# EAGLE design dev-board (EAGLE 7.0.0)
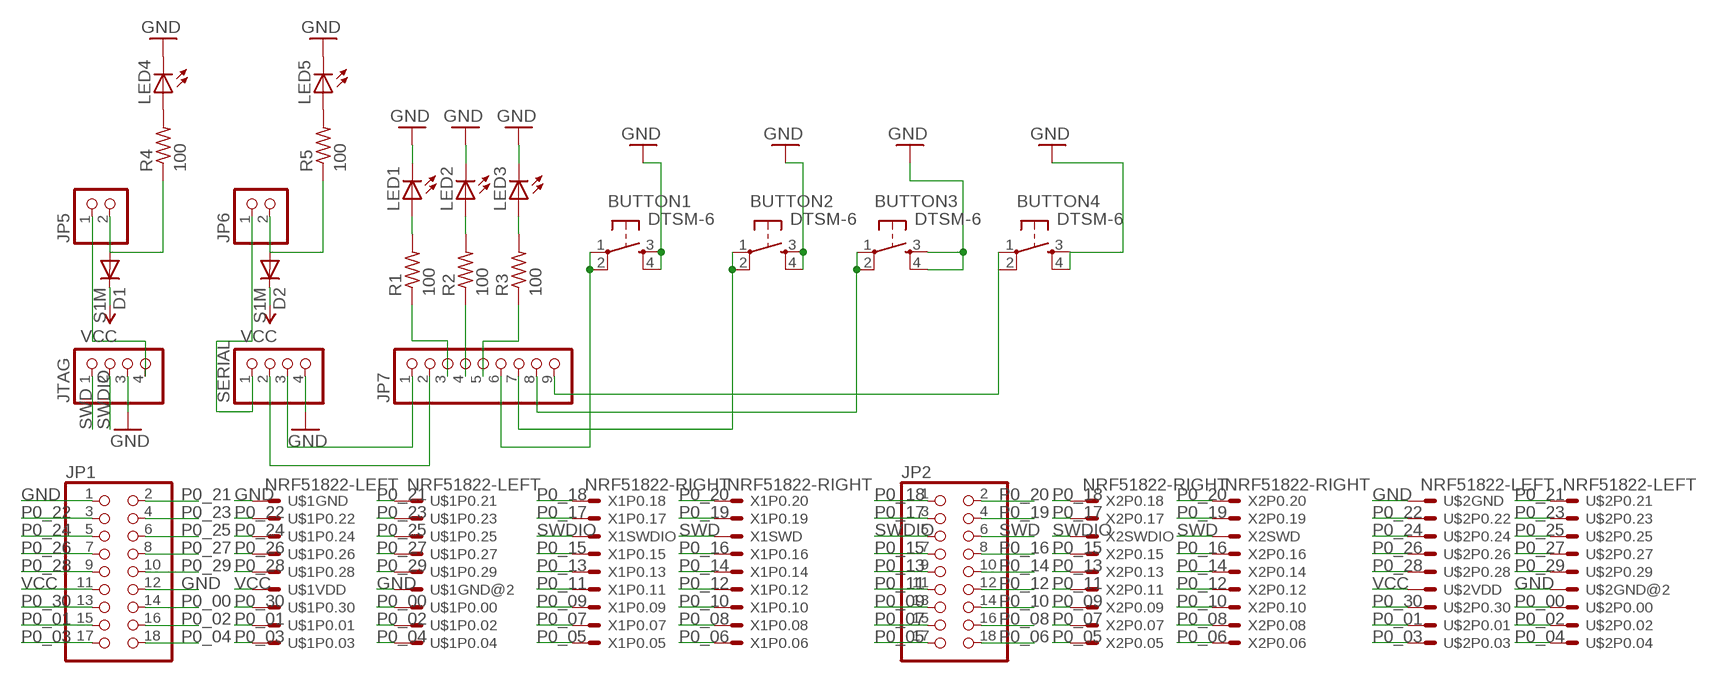
[diagram p0: schematic, sheet 1]

## Parts
BUTTON1  DTSM-6  [DTSM-6]
BUTTON2  DTSM-6  [DTSM-6]
BUTTON3  DTSM-6  [DTSM-6]
BUTTON4  DTSM-6  [DTSM-6]
D1  S1M  [SMA]
D2  S1M  [SMA]
JP1  PINHD-2X9  [2X09]
JP2  PINHD-2X9  [2X09]
JP5  PINHD-1X2  [1X02]
JP6  PINHD-1X2  [1X02]
JP7  PINHD-1X9  [1X09]
JTAG  PINHD-1X4  [1X04]
LED1  LEDSML0603  [SML0603]
LED2  LEDSML0603  [SML0603]
LED3  LEDSML0603  [SML0603]
LED4  LEDSML0603  [SML0603]
LED5  LEDSML0603  [SML0603]
R1  100  R-US_R0603  [R0603]
R2  100  R-US_R0603  [R0603]
R3  100  R-US_R0603  [R0603]
R4  100  R-US_R0603  [R0603]
R5  100  R-US_R0603  [R0603]
SERIAL  PINHD-1X4  [1X04]
U$1  NRF51822-LEFT  [NRF51822-LEFT]
U$2  NRF51822-LEFT  [NRF51822-LEFT]
X1  NRF51822-RIGHT  [NRF51822-RIGHT]
X2  NRF51822-RIGHT  [NRF51822-RIGHT]

## Nets
GND: BUTTON1.3 BUTTON1.4 BUTTON2.3 BUTTON2.4 BUTTON3.3 BUTTON3.4 BUTTON4.3 BUTTON4.4 JP1.1 JP1.12 JTAG.3 LED1.C LED2.C LED3.C LED4.C LED5.C SERIAL.4 U$1.1 U$1.12 U$2.1 U$2.12
N$1: LED1.A R1.2
N$2: LED2.A R2.2
N$3: LED3.A R3.2
N$4: JP7.1 SERIAL.3
N$5: JP7.2 SERIAL.2
N$6: JP6.1 SERIAL.1
N$7: JP7.3 R1.1
N$8: JP7.4 R2.1
N$9: JP5.1 JTAG.4
N$10: JP7.5 R3.1
N$11: BUTTON3.1 BUTTON3.2 JP7.8
N$12: LED4.A R4.2
N$13: BUTTON2.1 BUTTON2.2 JP7.7
N$15: LED5.A R5.2
N$16: BUTTON1.1 BUTTON1.2 JP7.6
N$17: BUTTON4.1 BUTTON4.2 JP7.9
N$18: D1.A JP5.2 R4.1
N$19: D2.A JP6.2 R5.1
P0_00: JP1.14 U$1.14 U$2.14
P0_01: JP1.15 U$1.15 U$2.15
P0_02: JP1.16 U$1.16 U$2.16
P0_03: JP1.17 U$1.17 U$2.17
P0_04: JP1.18 U$1.18 U$2.18
P0_05: JP2.17 X1.17 X2.17
P0_06: JP2.18 X1.18 X2.18
P0_07: JP2.15 X1.15 X2.15
P0_08: JP2.16 X1.16 X2.16
P0_09: JP2.13 X1.13 X2.13
P0_10: JP2.14 X1.14 X2.14
P0_11: JP2.11 X1.11 X2.11
P0_12: JP2.12 X1.12 X2.12
P0_13: JP2.9 X1.9 X2.9
P0_14: JP2.10 X1.10 X2.10
P0_15: JP2.7 X1.7 X2.7
P0_16: JP2.8 X1.8 X2.8
P0_17: JP2.3 X1.3 X2.3
P0_18: JP2.1 X1.1 X2.1
P0_19: JP2.4 X1.4 X2.4
P0_20: JP2.2 X1.2 X2.2
P0_21: JP1.2 U$1.2 U$2.2
P0_22: JP1.3 U$1.3 U$2.3
P0_23: JP1.4 U$1.4 U$2.4
P0_24: JP1.5 U$1.5 U$2.5
P0_25: JP1.6 U$1.6 U$2.6
P0_26: JP1.7 U$1.7 U$2.7
P0_27: JP1.8 U$1.8 U$2.8
P0_28: JP1.9 U$1.9 U$2.9
P0_29: JP1.10 U$1.10 U$2.10
P0_30: JP1.13 U$1.13 U$2.13
SWD: JP2.6 JTAG.1 X1.6 X2.6
SWDIO: JP2.5 JTAG.2 X1.5 X2.5
VCC: D1.C D2.C JP1.11 U$1.11 U$2.11

## Library data of the parts
BUTTON1-BUTTON4 = switch-tact:DTSM-6
D1 D2 = icarus_sensors:S1M
JP1 JP2 = pinhead:PINHD-2X9: PIN HEADER
JP5 JP6 = pinhead:PINHD-1X2: PIN HEADER
JP7 = pinhead:PINHD-1X9: PIN HEADER
JTAG SERIAL = pinhead:PINHD-1X4: PIN HEADER
LED1-LED5 = led:LED: LED OSRAM: - CHIPLED LG R971, LG N971, LY N971, LG Q971, LY Q971, LO R971, LY R971 LH N974, LH R974 LS Q976, LO Q976, LY Q976 LO Q996 - Hyper CHIPLED LW Q18S LB Q993, LB Q99A, LB R99A - SideLED LS A670, LO A670, LY A670, LG A670, LP A670 LB A673, LV A673, LT A673, LW A673 LH A674 LY A675 LS A676, LA A676, LO A676, LY A676, LW A676 LS A679, LY A679, LG A679 - Hyper Micro SIDELED® LS Y876, LA Y876, LO Y876, LY Y876 LT Y87S - SmartLED LW L88C, LW L88S LB L89C, LB L89S, LG L890 LS L89K, LO L89K, LY L89K LS L896, LA L896, LO L896, LY L896 - TOPLED LS T670, LO T670, LY T670, LG T670, LP T670 LSG T670, LSP T670, LSY T670, LOP T670, LYG T670 LG T671, LOG T671, LSG T671 LB T673, LV T673, LT T673, LW T673 LH T674 LS T676, LA T676, LO T676, LY T676, LB T676, LH T676, LSB T676, LW T676 LB T67C, LV T67C, LT T67C, LS T67K, LO T67K, LY T67K, LW E67C LS E67B, LA E67B, LO E67B, LY E67B, LB E67C, LV E67C, LT E67C LW T67C LS T679, LY T679, LG T679 LS T770, LO T770, LY T770, LG T770, LP T770 LB T773, LV T773, LT T773, LW T773 LH T774 LS E675, LA E675, LY E675, LS T675 LS T776, LA T776, LO T776, LY T776, LB T776 LHGB T686 LT T68C, LB T68C - Hyper Mini TOPLED® LB M676 - Mini TOPLED Santana® LG M470 LS M47K, LO M47K, LY M47K Source: http://www.osram.convergy.de LUXEON: - LUMILED® LXK2-PW12-R00, LXK2-PW12-S00, LXK2-PW14-U00, LXK2-PW14-V00 LXK2-PM12-R00, LXK2-PM12-S00, LXK2-PM14-U00 LXK2-PE12-Q00, LXK2-PE12-R00, LXK2-PE12-S00, LXK2-PE14-T00, LXK2-PE14-U00 LXK2-PB12-K00, LXK2-PB12-L00, LXK2-PB12-M00, LXK2-PB14-N00, LXK2-PB14-P00, LXK2-PB14-Q00 LXK2-PR12-L00, LXK2-PR12-M00, LXK2-PR14-Q00, LXK2-PR14-R00 LXK2-PD12-Q00, LXK2-PD12-R00, LXK2-PD12-S00 LXK2-PH12-R00, LXK2-PH12-S00 LXK2-PL12-P00, LXK2-PL12-Q00, LXK2-PL12-R00 Source: www.luxeon.com KINGBRIGHT: KA-3528ASYC Source: www.kingbright.com
R1-R5 = resistor:R-US_: RESISTOR, American symbol
U$1 U$2 = icarus_sensors:NRF51822-LEFT: left connector of NFR518822 board; MPN: NRF51822-left; OC_FARNELL: unknown; OC_NEWARK: 25M5675
X1 X2 = icarus_sensors:NRF51822-RIGHT: right connector of NFR518822 board; MPN: NRF51822-right; OC_FARNELL: unknown; OC_NEWARK: 25M5675

## Board
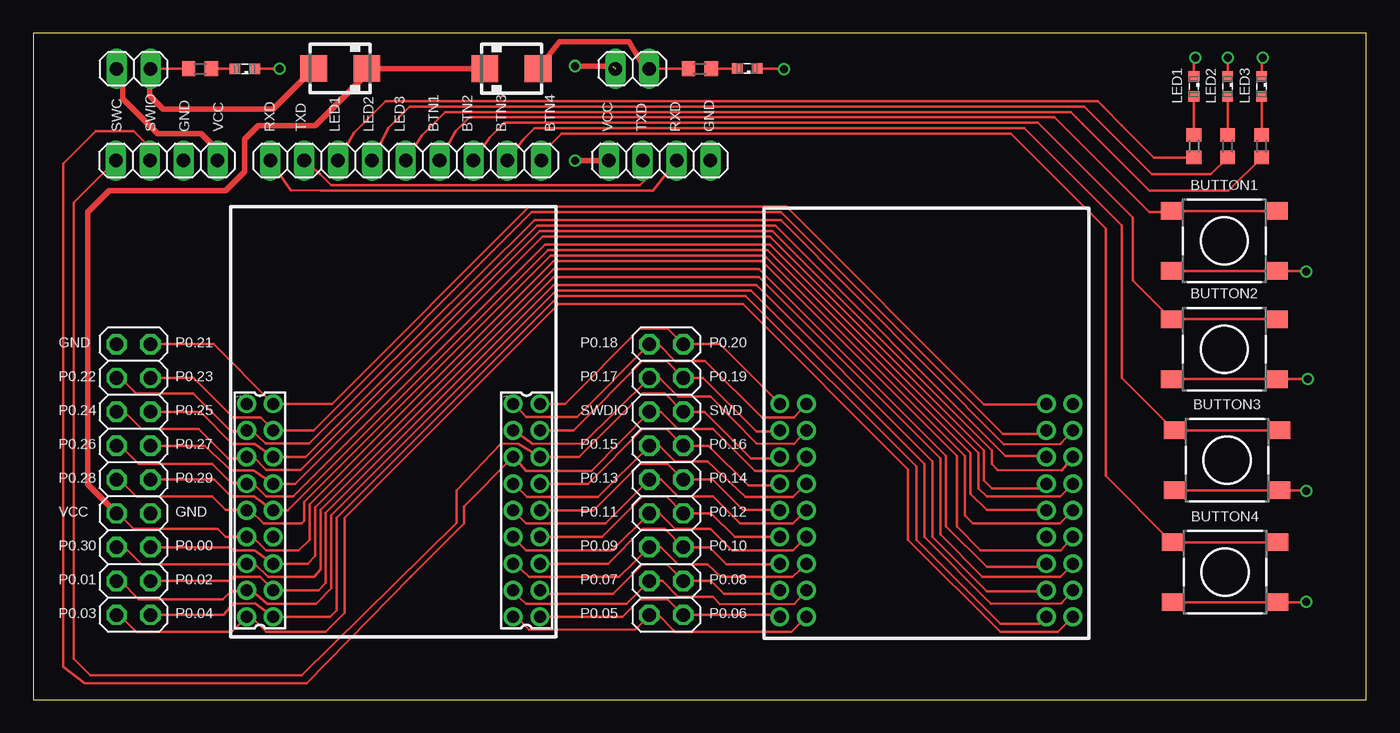
[diagram p1: board, top side]
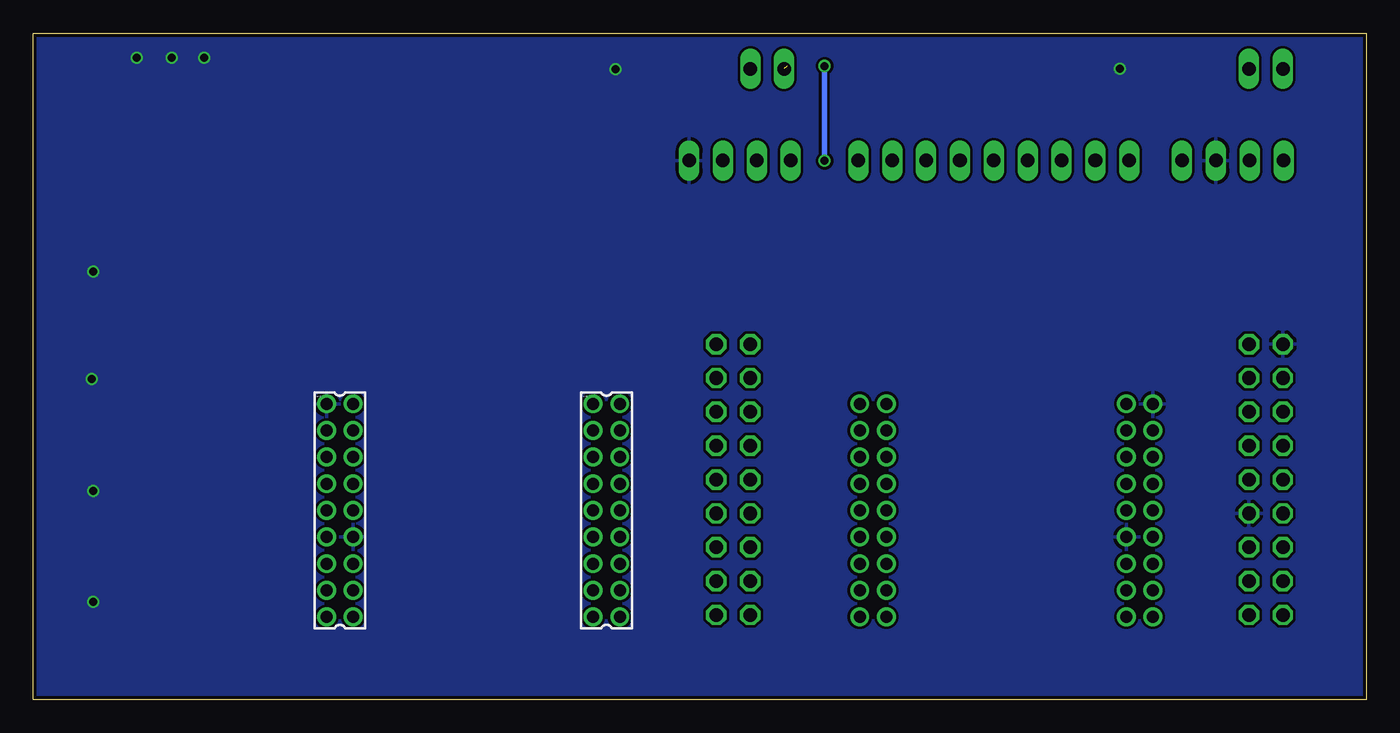
[diagram p2: board, bottom side, seen from below]

Size 100 x 50 mm. Coordinates in mm from the lower left corner, seen from the top.
Outline: 0,0 100,0 100,50 0,50 0,0
Copper layers (1*16): Top 0.035mm / dielectric 1.5mm / Bottom 0.035mm
Design rules "Elecrow_2-layer_eagle_rule *": minimum track width 6mil, minimum drill 12mil, track to track 8mil, track to pad 6mil, pad to pad 6mil, via to via 6mil, smd to smd 0mil, copper to edge 10mil, drill to drill 10mil, minimum pad ring 10mil, minimum via ring 6mil, stop-mask expansion 2mil, vias tented up to drill 100mil, thermal gap 10mil

### Footprints (pad centres in the part's own frame; a part is rotated, then mirrored left to right if it is on the bottom)
DTSM-6 = smd 1.55 x 1.3: 1 -3.975,2.25; 2 3.975,2.25; 3 -3.975,-2.25; 4 3.975,-2.25
SMA = smd 2 x 2: A 2,0; C -2,0
2X09 = drill 1.016 octagon: 1 -10.16,-1.27; 2 -10.16,1.27; 3 -7.62,-1.27; 4 -7.62,1.27; 5 -5.08,-1.27; 6 -5.08,1.27; 7 -2.54,-1.27; 8 -2.54,1.27; 9 0,-1.27; 10 0,1.27; 11 2.54,-1.27; 12 2.54,1.27; 13 5.08,-1.27; 14 5.08,1.27; 15 7.62,-1.27; 16 7.62,1.27; 17 10.16,-1.27; 18 10.16,1.27
1X02 = drill 1.016 long: 1 -1.27,0; 2 1.27,0
1X09 = drill 1.016 long: 1 -10.16,0; 2 -7.62,0; 3 -5.08,0; 4 -2.54,0; 5 0,0; 6 2.54,0; 7 5.08,0; 8 7.62,0; 9 10.16,0
1X04 = drill 1.016 long: 1 -3.81,0; 2 -1.27,0; 3 1.27,0; 4 3.81,0
SML0603 = smd 0.8 x 0.8: A 0.75,0; C -0.75,0
R0603 = smd 1 x 1.1: 1 -0.85,0; 2 0.85,0
NRF51822-LEFT = drill 0.9 pad 1.27: 1 -8,-1; 2 -8,1; 3 -6,-1; 4 -6,1; 5 -4,-1; 6 -4,1; 7 -2,-1; 8 -2,1; 9 0,-1; 10 0,1; 11 2,-1; 12 2,1; 13 4,-1; 14 4,1; 15 6,-1; 16 6,1; 17 8,-1; 18 8,1
NRF51822-RIGHT = drill 0.9 pad 1.27: 1 -8,-1; 2 -8,1; 3 -6,-1; 4 -6,1; 5 -4,-1; 6 -4,1; 7 -2,-1; 8 -2,1; 9 0,-1; 10 0,1; 11 2,-1; 12 2,1; 13 4,-1; 14 4,1; 15 6,-1; 16 6,1; 17 8,-1; 18 8,1

### Placement (x,y rotation side)
BUTTON1  89.36,34.42 0 top
BUTTON2  89.36,26.29 0 top
BUTTON3  89.56,17.96 0 top
BUTTON4  89.41,9.55 0 top
D1  23.04,47.35 180 top
D2  35.87,47.34 0 top
JP1  7.52,16.51 270 top
JP2  47.49,16.51 270 top
JP5  7.52,47.34 0 top
JP6  44.94,47.34 0 top
JP7  27.94,40.45 0 top
JTAG  10.01,40.45 0 top
LED1  87.07,46 270 top
LED2  89.61,46 270 top
LED3  92.15,46 270 top
LED4  15.86,47.33 180 top
LED5  53.56,47.35 180 top
R1  87.07,41.53 90 top
R2  89.61,41.53 90 top
R3  92.15,41.53 90 top
R4  12.51,47.34 0 top
R5  50,47.34 0 top
SERIAL  46.99,40.45 0 top
U$1  17,14.2 270 top
U$2  77,14.2 270 bottom
X1  37,14.2 270 top
X2  57,14.2 270 bottom

### Tracks (layer width: path | path; a pad name or v marks a point on that pad's centre or on a via)
GND  (via drill 0.6)
  Top 0.203: LED1.C 87.07,48.06 v87.17,48.16 | LED2.C v89.61,48.16 | LED3.C 92.15,48.06 v92.25,48.16 | LED5.C 56.28,47.35 v56.31,47.32 | LED4.C 18.45,47.33 v18.47,47.35 | BUTTON4.3 BUTTON4.4 95.49,7.3 v95.5,7.32 | BUTTON3.3 BUTTON3.4 95.44,15.71 v95.5,15.65 | BUTTON2.3 BUTTON2.4 95.62,24.04 v95.63,24.05 | BUTTON1.3 BUTTON1.4 95.44,32.17 v95.5,32.11
  pour Bottom: 0.2,49.99 99.97,49.99 99.97,0 0,0 0,50.19
N$1
  Top 0.203: R1.2 LED1.A
N$2
  Top 0.203: R2.2 LED2.A
N$3
  Top 0.203: R3.2 LED3.A
N$4
  Top 0.203: JP7.1 19.29,38.22 21.54,38.2 46.5,38.2 SERIAL.3
N$5
  Top 0.203: JP7.2 21.53,39.43 22.35,38.61 45.52,38.61 46.33,39.42 46.33,40.33 SERIAL.2
N$6  (via drill 0.6)  (1 unrouted)
  Top 0.305: 40.65,40.45 v40.64,40.44
  Top 0.406: SERIAL.1 40.65,40.45 | v40.64,47.55 43.46,47.55
  Bottom 0.406: v40.64,40.44 v40.64,47.55
N$7
  Top 0.203: JP7.3 24.07,42.56 26.42,44.91 79.86,44.91 80.26,44.5 81.69,43.08 84.08,40.68 R1.1
N$8
  Top 0.203: JP7.4 26.61,42.87 28.25,44.5 78.84,44.5 83.92,39.42 88.35,39.42 R2.1
N$9
  Top 0.406: JTAG.4 13.82,41.25 12.6,42.47 9.35,42.47 6.71,45.11 6.71,46.88 JP5.1
N$10
  Top 0.203: JP7.5 29.15,42.36 30.89,44.09 77.83,44.09 78.23,43.69 78.74,43.18 83.72,38.2 89.67,38.2 R3.1
N$11
  Top 0.203: JP7.8 36.77,42.05 37.59,42.88 74.37,42.88 81.69,35.56 81.69,24.11 BUTTON3.1 BUTTON3.2
N$12
  Top 0.203: R4.2 LED4.A
N$13
  Top 0.203: JP7.7 34.23,42.16 35.36,43.28 75.39,43.28 82.5,36.17 82.5,31.43 BUTTON2.1 92.97,28.54 93.47,28.04 93.47,28.41 BUTTON2.2
N$15
  Top 0.203: R5.2 52.8,47.34 LED5.A
N$16
  Top 0.203: JP7.6 31.69,42.66 32.72,43.69 76.61,43.69 83.72,36.58 85.29,36.58 BUTTON1.1 BUTTON1.2
N$17
  Top 0.203: JP7.9 38.1,40.95 39.62,42.47 73.36,42.47 80.47,35.36 80.47,16.77 BUTTON4.1 BUTTON4.2
N$18
  Top 0.203: JP5.2 R4.1
  Top 0.406: JP5.2 8.74,47.29 8.74,45.31 9.75,44.3 17.99,44.3 D1.A
N$19
  Top 0.203: JP6.2 R5.1
  Top 0.406: JP6.2 46.21,46.82 44.7,49.38 39.49,49.38 D2.A
P0_00
  Top 0.203: JP1.14 14.78,11.43 15.04,11.18 16.62,11.18 U$1.14 20.56,10.2 21.13,10.77 21.13,14.43 39.01,32.31 54.46,32.31 68.48,18.29 68.48,13.01 71.53,9.96 75.76,9.96 U$2.14
P0_01
  Top 0.203: JP1.15 6.55,8.89 7.92,7.52 14.22,7.52 14.83,8.13 15.93,8.13 U$1.15 16.39,8.2 17.53,7.19 21.23,7.19 22.35,8.33 22.35,13.82 39.22,30.68 53.85,30.68 66.85,17.68 66.85,12.19 71.83,7.19 77.11,7.21 U$2.15
P0_02
  Top 0.203: JP1.16 14.78,8.89 15.04,9.2 17,9.2 U$1.16 21.41,8.2 21.95,8.74 21.95,14.02 39.01,31.09 54.25,31.09 67.46,17.88 67.46,12.19 71.53,8.13 75.93,8.13 U$2.16
P0_03
  Top 0.203: JP1.17 6.45,6.35 7.72,5.08 14.88,5.08 U$1.17 16.36,6.2 17.48,5.08 21.95,5.08 23.37,6.5 23.37,13.61 39.42,29.67 53.24,29.67 65.63,17.27 65.63,11.99 72.54,5.08 76.88,5.08 U$2.17
P0_04
  Top 0.203: JP1.18 14.28,6.35 14.99,7.19 16.63,7.21 U$1.18 22.25,6.2 22.76,6.71 22.76,13.61 39.42,30.28 53.44,30.28 66.24,17.48 66.24,11.99 72.54,5.69 75.49,5.69 U$2.18
P0_05
  Top 0.203: X1.17 36.27,6.2 37.21,5.23 45.18,5.26 JP2.17 46.89,6.35 48.16,5.08 56.88,5.08 X2.17
P0_06
  Top 0.203: X1.18 44.2,6.2 45.52,7.52 47.59,7.52 JP2.18 55.85,6.35 X2.18
P0_07
  Top 0.203: X1.15 36,8.09 36.98,7.16 44.49,7.16 JP2.15 47.19,8.89 48.36,7.72 51,7.72 51.51,7.14 57.12,7.19 X2.15
P0_08
  Top 0.203: X1.16 38.27,7.92 43.48,7.92 45.72,10.16 47.55,10.16 48.76,8.95 JP2.16 50.85,8.89 51.82,7.92 55.73,7.92 X2.16
P0_09
  Top 0.203: X1.13 36.13,10.2 37.21,9.22 43.93,9.2 JP2.13 47.09,11.43 48.36,10.16 50.6,10.16 51.59,9.22 56.94,9.22 X2.13
P0_10
  Top 0.203: X1.14 43.12,10.2 45.72,12.8 47.39,12.8 JP2.14 50.75,11.43 52.02,10.16 55.96,10.16 X2.14
P0_11
  Top 0.203: X1.11 36,12.16 36.98,11.18 43.43,11.18 JP2.11 46.99,13.97 48.16,12.8 50.8,12.8 52.43,11.18 56.98,11.18 X2.11
P0_12
  Top 0.203: X1.12 42.68,12.2 45.72,15.24 47.49,15.24 JP2.12 50.85,13.97 52.63,12.19 X2.12
P0_13
  Top 0.203: X1.9 36.98,13.21 42.92,13.21 JP2.9 47.09,16.51 48.36,15.24 51,15.24 53.03,13.21 57.01,13.21 X2.9
P0_14
  Top 0.203: X1.10 42.04,14.2 45.52,17.68 47.59,17.68 JP2.10 50.95,16.51 53.24,14.22 55.98,14.22 X2.10
P0_15
  Top 0.203: X1.7 36.02,16.2 37.03,15.19 42.36,15.19 JP2.7 46.99,19.05 48.16,17.88 50.6,17.88 53.42,15.21 56.99,15.21 X2.7
P0_16
  Top 0.203: X1.8 41.6,16.2 45.72,20.32 47.49,20.32 JP2.8 50.65,19.05 53.65,16.05 55.85,16.05 X2.8
P0_17
  Top 0.203: X1.3 36.09,20.2 37.47,19.18 41.24,19.2 JP2.3 46.99,24.13 48.36,22.76 50.8,22.76 54.25,19.2 57.05,19.18 X2.3
P0_18
  Top 0.203: X1.1 36.12,22.2 36.98,21.21 40.78,21.21 JP2.1 46.89,26.67 48.16,25.4 50.39,25.4 54.66,21.18 57.06,21.18 X2.1
P0_19
  Top 0.203: X1.4 40.52,20.2 45.72,25.4 47.49,25.4 JP2.4 50.24,24.13 54.25,20.12 55.92,20.12 X2.4
P0_20
  Top 0.203: X1.2 39.88,22.2 45.52,27.84 47.59,27.84 JP2.2 51.53,26.67 X2.2
P0_21
  Top 0.203: JP1.2 13.53,26.67 U$1.2 22.4,22.2 37.19,36.98 56.49,36.98 71.32,22.15 75.95,22.15 U$2.2
P0_22
  Top 0.203: JP1.3 6.55,24.13 7.72,22.96 11.99,22.96 14.83,20.12 15.92,20.12 U$1.3 16.38,20.2 17.45,19.23 20.68,19.23 37.59,35.97 56.08,35.97 72.82,19.15 77.05,19.18 U$2.3
P0_23
  Top 0.203: JP1.4 12.04,24.13 14.99,21.16 17.07,21.16 U$1.4 21.01,20.2 37.39,36.58 56.08,36.58 72.75,19.91 75.71,19.91 U$2.4
P0_24
  Top 0.203: JP1.5 6.86,21.59 8.13,20.32 12.39,20.32 14.63,18.09 15.88,18.09 U$1.5 16.55,18.2 17.48,17.22 20.04,17.22 38,35.15 55.47,35.15 71.93,18.69 71.93,17.68 72.34,17.22 77.17,17.2 U$2.5
P0_25
  Top 0.203: JP1.6 12.55,21.59 14.91,19.18 16.59,19.18 U$1.6 20.43,18.2 37.8,35.56 55.68,35.56 72.95,18.29 75.91,18.29 U$2.6
P0_26
  Top 0.203: JP1.7 6.55,19.05 7.92,17.68 13.41,17.68 14.83,16.26 15.94,16.26 U$1.7 16.52,16.2 17.48,15.24 19.51,15.24 38.41,34.14 55.27,34.14 70.92,18.49 70.92,15.85 71.53,15.24 77.04,15.24 U$2.7
P0_27
  Top 0.203: JP1.8 12.85,19.05 14.83,17.2 16.52,17.2 U$1.8 19.65,16.2 38.2,34.75 55.27,34.75 71.32,18.69 71.32,16.46 71.93,15.85 75.65,15.85 U$2.8
P0_28
  Top 0.203: JP1.9 6.45,16.51 7.72,15.24 13.41,15.24 14.43,14.22 15.98,14.22 U$1.9 16.28,14.2 17.27,13.21 20.12,13.21 20.32,13.41 20.32,14.83 38.81,33.33 54.86,33.33 69.9,18.29 69.9,13.82 70.51,13.21 77.01,13.21 U$2.9
P0_29
  Top 0.203: JP1.10 13.56,16.51 14.83,15.24 16.55,15.24 U$1.10 19.08,14.2 38.61,33.73 55.07,33.73 70.31,18.49 70.31,15.44 71.53,14.22 75.98,14.22 U$2.10
P0_30
  Top 0.203: JP1.13 6.86,11.43 8.13,10.16 15.96,10.16 U$1.13 16.62,10.2 17.6,9.22 21.06,9.22 21.54,9.75 21.54,14.22 39.01,31.7 54.46,31.7 68.07,18.09 68.07,12.39 71.2,9.2 77.07,9.2 U$2.13
SWD
  Top 0.203: JTAG.1 3.05,37.3 3.05,3.05 4.27,1.83 20.12,1.83 31.74,13.25 31.74,15.69 35.1,19.2 36.39,19.18 X1.6 40.96,18.2 45.72,22.96 47.39,22.96 JP2.6 50.34,21.59 53.85,18.09 55.88,18.09 X2.6
SWDIO
  Top 0.203: JTAG.2 8.53,40.65 8.53,41.66 7.52,42.67 4.67,42.67 2.23,40.23 2.23,2.44 3.86,1.22 20.52,1.22 28.32,9.22 32.31,13.21 32.31,14.51 X1.5 36.05,18.2 36.96,17.17 41.88,17.14 JP2.5 47.09,21.59 48.36,20.32 51,20.32 54.15,17.14 57.02,17.17 X2.5
VCC
  Top 0.203: JP1.11 6.35,13.97 7.52,12.8 13.82,12.8 14.43,12.19 U$1.11 | U$1.11 16.46,12.19 17.48,11.18 19.91,11.18 20.73,11.99 20.73,14.63 39.01,32.92 54.66,32.92 69.29,18.29 69.29,13.01 71.07,11.2 77.08,11.2 U$2.11 | U$1.11
  Top 0.406: D2.C D1.C 25.04,46.98 21.13,43.08 16.87,43.08 15.85,42.06 15.85,39.62 14.43,38.2 5.69,38.2 4.06,36.58 4.06,16.16 JP1.11

### Text on the board
tNames: SWC | SWIO | GND | VCC | RXD | TXD | LED1 | LED2 | LED3 | BTN1 | BTN2 | BTN3 | BTN4 | VCC | TXD | RXD | GND | GND | P0.21 | P0.18 | P0.20 | P0.22 | P0.23 | P0.17 | P0.19 | P0.24 | P0.25 | SWDIO | SWD | P0.26 | P0.27 | P0.15 | P0.16 | P0.28 | P0.29 | P0.13 | P0.14 | VCC | GND | P0.11 | P0.12 | P0.30 | P0.00 | P0.09 | P0.10 | P0.01 | P0.02 | P0.07 | P0.08 | P0.03 | P0.04 | P0.05 | P0.06